# Altium schematic sheet I2C_SENSOR.SchDoc: I2C_SENSOR
size 420 x 297 mm; SheetNumber: 10; SheetTotal: 12
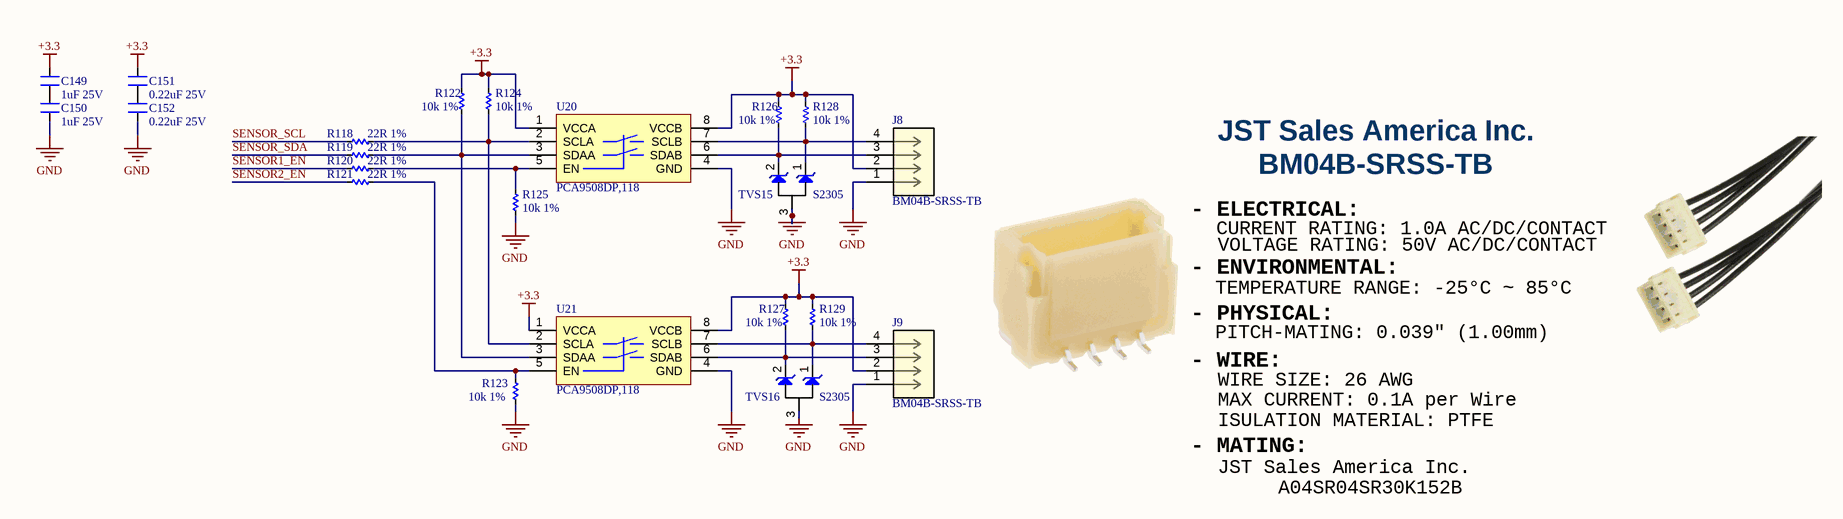
[diagram p0: I2C_SENSOR.SchDoc]

## Parts
C149  1uF 25V  [CN-SMD-0603-EXP-V101]
C150  1uF 25V  [CN-SMD-0603-EXP-V101]
C151  0.22uF 25V  [CN-SMD-0603-EXP-V101]
C152  0.22uF 25V  [CN-SMD-0603-EXP-V101]
J8  BM04B-SRSS-TB  [BM04B-SRSS-TB]
J9  BM04B-SRSS-TB  [BM04B-SRSS-TB]
R118  22R 1%  [RES-SMD-0603-EXP-V101]
R119  22R 1%  [RES-SMD-0603-EXP-V101]
R120  22R 1%  [RES-SMD-0603-EXP-V101]
R121  22R 1%  [RES-SMD-0603-EXP-V101]
R122  10k 1%  [RES-SMD-0603-EXP-V101]
R123  10k 1%  [RES-SMD-0603-EXP-V101]
R124  10k 1%  [RES-SMD-0603-EXP-V101]
R125  10k 1%  [RES-SMD-0603-EXP-V101]
R126  10k 1%  [RES-SMD-0603-EXP-V101]
R127  10k 1%  [RES-SMD-0603-EXP-V101]
R128  10k 1%  [RES-SMD-0603-EXP-V101]
R129  10k 1%  [RES-SMD-0603-EXP-V101]
TVS15  S2305  [sot23-12_3]
TVS16  S2305  [sot23-12_3]
U20  PCA9508DP,118  [TSOP8]
U21  PCA9508DP,118  [TSOP8]

## Nets
+3.3: C149.2 C151.2 J8.2 J9.2 R122.1 R124.1 R126.1 R127.1 R128.1 R129.1 U20.1(VCCA) U20.8(VCCB) U21.1(VCCA) U21.8(VCCB)
GND: C150.1 C152.1 J8.1 J9.1 R123.2 R125.2 TVS15.3 TVS16.3 U20.4(GND) U21.4(GND)
SENSOR1_EN: R120.1
SENSOR2_EN: R121.1
SENSOR_SCL: R118.1
SENSOR_SDA: R119.1
NetC149_1: C149.1 C150.2
NetC151_1: C151.1 C152.2
NetJ8_3: J8.3 R126.2 TVS15.2 U20.6(SDAB)
NetJ8_4: J8.4 R128.2 TVS15.1 U20.7(SCLB)
NetJ9_3: J9.3 R127.2 TVS16.2 U21.6(SDAB)
NetJ9_4: J9.4 R129.2 TVS16.1 U21.7(SCLB)
NetR118_2: R118.2 R124.2 U20.2(SCLA) U21.2(SCLA)
NetR119_2: R119.2 R122.2 U20.3(SDAA) U21.3(SDAA)
NetR120_2: R120.2 R125.1 U20.5(EN)
NetR121_2: R121.2 R123.1 U21.5(EN)

## Notes on the sheet
- JST Sales America Inc.
- BM04B-SRSS-TB
- - ELECTRICAL:
- CURRENT RATING: 1.0A AC/DC/CONTACT
- VOLTAGE RATING: 50V AC/DC/CONTACT
- - ENVIRONMENTAL:
- - PHYSICAL:
- TEMPERATURE RANGE: -25°C ~ 85°C
- - WIRE:
- PITCH-MATING: 0.039" (1.00mm)
- WIRE SIZE: 26 AWG
- - MATING:
- MAX CURRENT: 0.1A per Wire
- ISULATION MATERIAL: PTFE
- A04SR04SR30K152B
- Project:
- PEE-PC1
- Sub-system:
- NANORACK_EXP_CONTROLLER
- Design by:
- SANG HUYNH
- BAO BUI Q.
- Sheet title:
- Sheet
- A3
- of
- Checked by:
- Approved by:
- VU PHAM
- Revision:
- Document No:
- V1.0.0
- Size:
- Date:

## Library data of the parts
C149-C152 = Capacitors: Value: 33pF
J8 J9 = BM04B-SRSS-TB: CONN HEADER SMD 4POS 1MM
R118-R129 = Res SMD: SMD; Manufacturer: Generic Components; Class: Passive; Published: 08/06/2000; Publisher: Altium Hobart Technology Centre
TVS15 TVS16 = S2305: TVS DIODE 5VWM 10.8VC SOT23